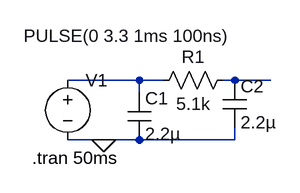
[diagram p0: schematic pi_filter.asc]
pi_filter.asc, the LTspice schematic file:
Version 4.1
SHEET 1 880 680
WIRE 112 112 16 112
WIRE 144 112 112 112
WIRE 240 112 224 112
WIRE 288 112 240 112
WIRE 112 128 112 112
WIRE 64 192 16 192
WIRE 112 192 64 192
WIRE 240 192 240 176
WIRE 240 192 112 192
FLAG 64 192 0
SYMBOL res 240 96 R90
WINDOW 0 0 56 VBottom 2
WINDOW 3 32 56 VTop 2
SYMATTR InstName R1
SYMATTR Value 5.1k
SYMBOL cap 96 128 R0
SYMATTR InstName C1
SYMATTR Value 2.2µ
SYMBOL voltage 16 96 R0
WINDOW 3 -59 -44 Left 2
WINDOW 123 0 0 Left 0
WINDOW 39 0 0 Left 0
SYMATTR Value PULSE(0 3.3 1ms 100ns)
SYMATTR InstName V1
SYMBOL cap 224 112 R0
SYMATTR InstName C2
SYMATTR Value 2.2µ
TEXT -32 216 Left 2 !.tran 50ms

The netlist it stands for:
* pi_filter.asc
R1 N002 N001 5.1k
C1 N001 0 2.2µ
V1 N001 0 PULSE(0 3.3 1ms 100ns)
C2 N002 0 2.2µ
.tran 50ms
.backanno
.end